# Altium schematic sheet Bias Regulators 2.SchDoc: System Bias Regulators - Comparitors
size A4; ApprovedBy: LD Stanton; Author: LD Stanton; CompanyName: University of Cape Town; DrawnBy: Lawrence Stanton; Engineer: Lawrence Stanton; Organization: University of Cape Town; Address1: Department of Electrical Engineering; Address2: Rondebosch; Address3: Cape Town; Address4: South Africa 7701; DocumentNumber: 10; SheetNumber: 10; SheetTotal: 20
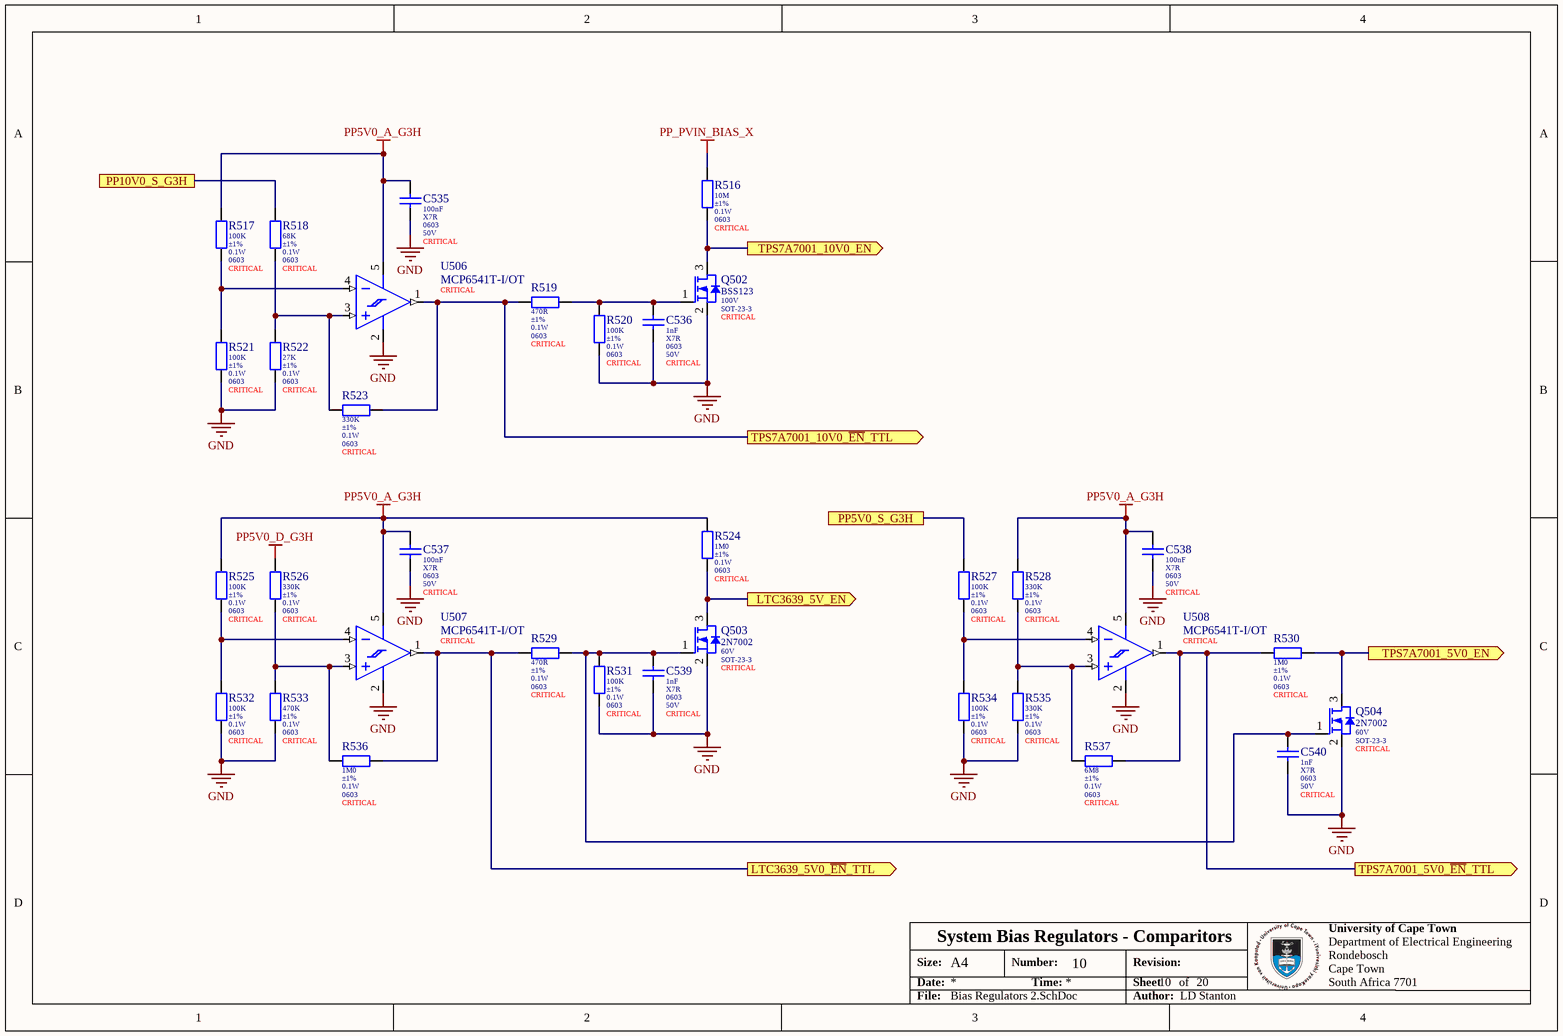
[diagram p0: Bias Regulators 2.SchDoc]

## Parts
C535  value 100nF  Dielectric: X7R  Package: 0603  Voltage: 50V  Populate: CRITICAL  [0603 (Yageo DA) B]  (hidden comment: CC0603KRX7R9BB104)
C536  value 1nF  Dielectric: X7R  Package: 0603  Voltage: 50V  Populate: CRITICAL  [0603_080_8 (Samsung) B]  (hidden comment: CL10B102KB8NNNC)
C537  value 100nF  Dielectric: X7R  Package: 0603  Voltage: 50V  Populate: CRITICAL  [0603 (Yageo DA) B]  (hidden comment: CC0603KRX7R9BB104)
C538  value 100nF  Dielectric: X7R  Package: 0603  Voltage: 50V  Populate: CRITICAL  [0603 (Yageo DA) B]  (hidden comment: CC0603KRX7R9BB104)
C539  value 1nF  Dielectric: X7R  Package: 0603  Voltage: 50V  Populate: CRITICAL  [0603_080_8 (Samsung) B]  (hidden comment: CL10B102KB8NNNC)
C540  value 1nF  Dielectric: X7R  Package: 0603  Voltage: 50V  Populate: CRITICAL  [0603_080_8 (Samsung) B]  (hidden comment: CL10B102KB8NNNC)
Q502  BSS123  Maximum Drain Source Voltage: 100V  Package: SOT-23-3  Placement: CRITICAL  [SOT-23-3 (2N7002) B]
Q503  2N7002  Maximum Drain Source Voltage: 60V  Package: SOT-23-3  Placement: CRITICAL  [SOT-23-3 (2N7002) B]
Q504  2N7002  Maximum Drain Source Voltage: 60V  Package: SOT-23-3  Placement: CRITICAL  [SOT-23-3 (2N7002) B]
R516  value 10M  Tolerance: ±1%  Power: 0.1W  Package: 0603  Populate: CRITICAL  [0603 (Uniroyal) B]  (hidden comment: 0603WAF1005T5E)
R517  value 100K  Tolerance: ±1%  Power: 0.1W  Package: 0603  Populate: CRITICAL  [0603 (Uniroyal) B]  (hidden comment: 0603WAF1003T5E)
R518  value 68K  Tolerance: ±1%  Power: 0.1W  Package: 0603  Populate: CRITICAL  [0603 (Uniroyal) B]  (hidden comment: 0603WAF6802T5E)
R519  value 470R  Tolerance: ±1%  Power: 0.1W  Package: 0603  Populate: CRITICAL  [0603 (Uniroyal) B]  (hidden comment: 0603WAF4700T5E)
R520  value 100K  Tolerance: ±1%  Power: 0.1W  Package: 0603  Populate: CRITICAL  [0603 (Uniroyal) B]  (hidden comment: 0603WAF1003T5E)
R521  value 100K  Tolerance: ±1%  Power: 0.1W  Package: 0603  Populate: CRITICAL  [0603 (Uniroyal) B]  (hidden comment: 0603WAF1003T5E)
R522  value 27K  Tolerance: ±1%  Power: 0.1W  Package: 0603  Populate: CRITICAL  [0603 (Uniroyal) B]  (hidden comment: 0603WAF2702T5E)
R523  value 330K  Tolerance: ±1%  Power: 0.1W  Package: 0603  Populate: CRITICAL  [0603 (Uniroyal) B]  (hidden comment: 0603WAF3303T5E)
R524  value 1M0  Tolerance: ±1%  Power: 0.1W  Package: 0603  Populate: CRITICAL  [0603 (Uniroyal) B]  (hidden comment: 0603WAF1004T5E)
R525  value 100K  Tolerance: ±1%  Power: 0.1W  Package: 0603  Populate: CRITICAL  [0603 (Uniroyal) B]  (hidden comment: 0603WAF1003T5E)
R526  value 330K  Tolerance: ±1%  Power: 0.1W  Package: 0603  Populate: CRITICAL  [0603 (Uniroyal) B]  (hidden comment: 0603WAF3303T5E)
R527  value 100K  Tolerance: ±1%  Power: 0.1W  Package: 0603  Populate: CRITICAL  [0603 (Uniroyal) B]  (hidden comment: 0603WAF1003T5E)
R528  value 330K  Tolerance: ±1%  Power: 0.1W  Package: 0603  Populate: CRITICAL  [0603 (Uniroyal) B]  (hidden comment: 0603WAF3303T5E)
R529  value 470R  Tolerance: ±1%  Power: 0.1W  Package: 0603  Populate: CRITICAL  [0603 (Uniroyal) B]  (hidden comment: 0603WAF4700T5E)
R530  value 1M0  Tolerance: ±1%  Power: 0.1W  Package: 0603  Populate: CRITICAL  [0603 (Uniroyal) B]  (hidden comment: 0603WAF1004T5E)
R531  value 100K  Tolerance: ±1%  Power: 0.1W  Package: 0603  Populate: CRITICAL  [0603 (Uniroyal) B]  (hidden comment: 0603WAF1003T5E)
R532  value 100K  Tolerance: ±1%  Power: 0.1W  Package: 0603  Populate: CRITICAL  [0603 (Uniroyal) B]  (hidden comment: 0603WAF1003T5E)
R533  value 470K  Tolerance: ±1%  Power: 0.1W  Package: 0603  Populate: CRITICAL  [0603 (Uniroyal) B]  (hidden comment: 0603WAF4703T5E)
R534  value 100K  Tolerance: ±1%  Power: 0.1W  Package: 0603  Populate: CRITICAL  [0603 (Uniroyal) B]  (hidden comment: 0603WAF1003T5E)
R535  value 330K  Tolerance: ±1%  Power: 0.1W  Package: 0603  Populate: CRITICAL  [0603 (Uniroyal) B]  (hidden comment: 0603WAF3303T5E)
R536  value 1M0  Tolerance: ±1%  Power: 0.1W  Package: 0603  Populate: CRITICAL  [0603 (Uniroyal) B]  (hidden comment: 0603WAF1004T5E)
R537  value 6M8  Tolerance: ±1%  Power: 0.1W  Package: 0603  Populate: CRITICAL  [0603 (Uniroyal) B]  (hidden comment: 0603WAF6804T5E)
U506  MCP6541T-I/OT  Placement: CRITICAL  [SOT-23-5 (MCP75x) B]
U507  MCP6541T-I/OT  Placement: CRITICAL  [SOT-23-5 (MCP75x) B]
U508  MCP6541T-I/OT  Placement: CRITICAL  [SOT-23-5 (MCP75x) B]

## Ports
LTC3639_5V0_~{EN}_TTL (out), LTC3639_5V_EN (out), PP5V0_S_G3H, PP10V0_S_G3H, TPS7A7001_5V0_EN (out), TPS7A7001_5V0_~{EN}_TTL (out), TPS7A7001_10V0_EN (out), TPS7A7001_10V0_~{EN}_TTL (out)

## Nets
GND: C535.2 C536.2 C537.2 C538.2 C539.2 C540.2 Q502.2(S) Q503.2(S) Q504.2(S) R520.2 R521.2 R522.2 R531.2 R532.2 R533.2 R534.2 R535.2 U506.2(VSS) U507.2(VSS) U508.2(VSS)
PP5V0_A_G3H: C535.1 C537.1 C538.1 R517.1 R524.1 R525.1 R528.1 U506.5(VDD) U507.5(VDD) U508.5(VDD)
PP5V0_D_G3H: R526.1
PP_PVIN_BIAS_X: R516.1
LTC3639_5V0_~{EN}_TTL: R529.1 R536.2 U507.1(OUT) ; port LTC3639_5V0_~{EN}_TTL
LTC3639_5V_EN: Q503.3(D) R524.2 ; port LTC3639_5V_EN
PP5V0_S_G3H: R527.1 ; port PP5V0_S_G3H
PP10V0_S_G3H: R518.1 ; port PP10V0_S_G3H
TPS7A7001_5V0_~{EN}_TTL: R530.1 R537.2 U508.1(OUT) ; port TPS7A7001_5V0_~{EN}_TTL
TPS7A7001_5V0_EN: Q504.3(D) R530.2 ; port TPS7A7001_5V0_EN
TPS7A7001_10V0_~{EN}_TTL: R519.1 R523.2 U506.1(OUT) ; port TPS7A7001_10V0_~{EN}_TTL
TPS7A7001_10V0_EN: Q502.3(D) R516.2 ; port TPS7A7001_10V0_EN
NetC536_1: C536.1 Q502.1(G) R519.2 R520.1
NetC539_1: C539.1 C540.1 Q503.1(G) Q504.1(G) R529.2 R531.1
NetR517_2: R517.2 R521.1 U506.4(VIN-)
NetR518_2: R518.2 R522.1 R523.1 U506.3(VIN+)
NetR525_2: R525.2 R532.1 U507.4(VIN-)
NetR526_2: R526.2 R533.1 R536.1 U507.3(VIN+)
NetR527_2: R527.2 R534.1 U508.4(VIN-)
NetR528_2: R528.2 R535.1 R537.1 U508.3(VIN+)

## Notes on the sheet
- Size:
- Date:
- A4
- Number:
- Time:
- Revision:
- Sheet
- of
- File:
- Author:

## Library data of the parts
C535 C537 C538 = CMP-047-000000-7: MLCC 100nF 50V 0603 X7R ±10%; Manufacturer: Yageo; LCSC Part Number: C14663; Tolerance: ±10%; ComponentLink1URL: https://datasheet.lcsc.com/szlcsc/YAGEO-CC0603KRX7R9BB104_C14663.pdf; ComponentLink1Description: Datasheet
C536 C539 C540 = CMP-045-000000-8: MLCC 1nF 0603 50V X7R ±10%; Manufacturer: Samsung; Tolerance: ±10%; LCSC Part Number: C1588; ComponentLink1Description: Datasheet; ComponentLink1URL: https://datasheet.lcsc.com/szlcsc/Samsung-Electro-Mechanics-CL05C100JB5NNNC_C32949.pdf
Q502 = CMP-040-000009-11: Small Signal MOSFET, 170mA, 100V, N-Channel, Enhancement, JCET SOT-23-3; Power: 0.35W; Maximum Drain Current: 0.17A; Maximum Gate Source Voltage: ±20V; Drain-Source On Resistance: 10R; Gate Threshold Voltage: 2V8; Manufacturer: JCET; LCSC Part Number: C79015; ComponentLink1URL: https://datasheet.lcsc.com/lcsc/1809211016_Changjiang-Electronics-Tech--CJ-BSS123_C79015.pdf; ComponentLink1Description: Datasheet
Q503 Q504 = CMP-040-000000-14: Small Signal MOSFET, 500 mA, 60 V, N-Channel, Enhancement, JCET SOT-23-3; Drain-Source On Resistance: 7R; Maximum Gate Source Voltage: ±20V; Maximum Drain Current: 0.2A; Gate Threshold Voltage: 2V5; Power: 0.225W; LCSC Part Number: C8545; ComponentLink1URL: https://datasheet.lcsc.com/szlcsc/Changjiang-Electronics-Tech-CJ-2N7002_C8545.pdf; Manufacturer: JCET; ComponentLink1Description: Datasheet
R516 = CMP-010-000294-9: Resistor 10M 0603 ±1% Thick Film Uniroyal; Working Voltage: 75V; Temperature Coefficient: ±200ppm/K; Temperature: -55 - 155°C; Pin Count: 2; ComponentLink1URL: https://datasheet.lcsc.com/szlcsc/1811062009_UNI-ROYAL-Uniroyal-Elec-0603WAF1002T5E_C25804.pdf; Manufacturer: Uniroyal; LCSC Part Number: C7250; ComponentLink1Description: Datasheet
R517 R520 R521 R525 R527 R531 R532 R534 = CMP-010-000288-10: Resistor 100K 0603 ±1% Thick Film Uniroyal; Working Voltage: 75V; Temperature Coefficient: ±100ppm/K; Manufacturer: Uniroyal; ComponentLink1URL: https://datasheet.lcsc.com/szlcsc/1811062009_UNI-ROYAL-Uniroyal-Elec-0603WAF1002T5E_C25804.pdf; LCSC Part Number: C25803; Temperature: -55 - 155°C; ComponentLink1Description: Datasheet; Pin Count: 2
R518 = CMP-010-000350-9: Resistor 68K 0603 ±1% Thick Film Uniroyal; Working Voltage: 75V; Temperature Coefficient: ±100ppm/K; Manufacturer: Uniroyal; ComponentLink1Description: Datasheet; Temperature: -55 - 155°C; ComponentLink1URL: https://datasheet.lcsc.com/szlcsc/1811062009_UNI-ROYAL-Uniroyal-Elec-0603WAF1002T5E_C25804.pdf; Pin Count: 2; LCSC Part Number: C23231
R519 R529 = CMP-010-000381-2: Resistor 470R 0603 ±5% Thick Film Uniroyal; Working Voltage: 75V; Temperature Coefficient: ±100ppm/K; ComponentLink1Description: Datasheet; Manufacturer: Uniroyal; Temperature: -55 - 155°C; LCSC Part Number: C23179; ComponentLink1URL: https://datasheet.lcsc.com/szlcsc/1811062009_UNI-ROYAL-Uniroyal-Elec-0603WAF1002T5E_C25804.pdf; Pin Count: 2
R522 = CMP-010-000322-10: Resistor 27K 0603 ±1% Thick Film Uniroyal; Temperature Coefficient: ±100ppm/K; Working Voltage: 75V; Manufacturer: Uniroyal; LCSC Part Number: C22967; ComponentLink1Description: Datasheet; Temperature: -55 - 155°C; ComponentLink1URL: https://datasheet.lcsc.com/szlcsc/1811062009_UNI-ROYAL-Uniroyal-Elec-0603WAF1002T5E_C25804.pdf; Pin Count: 2
R523 R526 R528 R535 = CMP-010-000382-2: Resistor 330K 0603 ±1% Thick Film Uniroyal; Temperature Coefficient: ±100ppm/K; Working Voltage: 75V; Pin Count: 2; Manufacturer: Uniroyal; ComponentLink1URL: https://datasheet.lcsc.com/szlcsc/1811062009_UNI-ROYAL-Uniroyal-Elec-0603WAF1002T5E_C25804.pdf; LCSC Part Number: C23137; Temperature: -55 - 155°C; ComponentLink1Description: Datasheet
R524 R530 R536 = CMP-010-000313-12: Resistor 1M0 0603 ±1% Thick Film Uniroyal; Working Voltage: 75V; Temperature Coefficient: ±100ppm/K; Manufacturer: Uniroyal; Pin Count: 2; LCSC Part Number: C22935; Temperature: -55 - 155°C; ComponentLink1Description: Datasheet; ComponentLink1URL: https://datasheet.lcsc.com/szlcsc/1811062009_UNI-ROYAL-Uniroyal-Elec-0603WAF1002T5E_C25804.pdf
R533 = CMP-010-000402-2: Resistor 470K 0603 ±1% Thick Film Uniroyal; Temperature Coefficient: ±100ppm/K; Working Voltage: 75V; ComponentLink1URL: https://datasheet.lcsc.com/szlcsc/1811062009_UNI-ROYAL-Uniroyal-Elec-0603WAF1002T5E_C25804.pdf; Pin Count: 2; Temperature: -55 - 155°C; LCSC Part Number: C23178; ComponentLink1Description: Datasheet; Manufacturer: Uniroyal
R537 = CMP-010-000375-3: Resistor 6M8 0603 ±1% Thick Film Uniroyal; Temperature Coefficient: ±200ppm/K; Working Voltage: 75V; ComponentLink1Description: Datasheet; Temperature: -55 - 155°C; ComponentLink1URL: https://datasheet.lcsc.com/szlcsc/1811062009_UNI-ROYAL-Uniroyal-Elec-0603WAF1002T5E_C25804.pdf; LCSC Part Number: C23213; Manufacturer: Uniroyal; Pin Count: 2
U506-U508 = CMP-000025-4: Comparator, Push-Pull, 1V6-5V5, 600nA,  SOT-23-5; Min Supply Voltage: 1.6V; Max Supply Voltage: 5.5V; Propagation Delay: 8us; Quiescent Current: 1uA; Nominal Supply Current: 1mA; Input Bias Current: 1pA; Input Offset Voltage (Vos): 7mV; Hysteresis: 6.5mV; Output Current: 2mA; Package: SOT-23-5; ComponentLink1Description: Datasheet; Output Type: Push-Pull; Min Operating Temperature: -40°C; RoHS: Yes; Max Operating Temperature: 85°C; ComponentLink1URL: https://ww1.microchip.com/downloads/en/DeviceDoc/MCP6541%20Output%20SubMicroamp%20Comparators%2020001696K.pdf; LCSC Part Number: C80839